# EAGLE design Qwiic-Step (EAGLE 9.5.1)
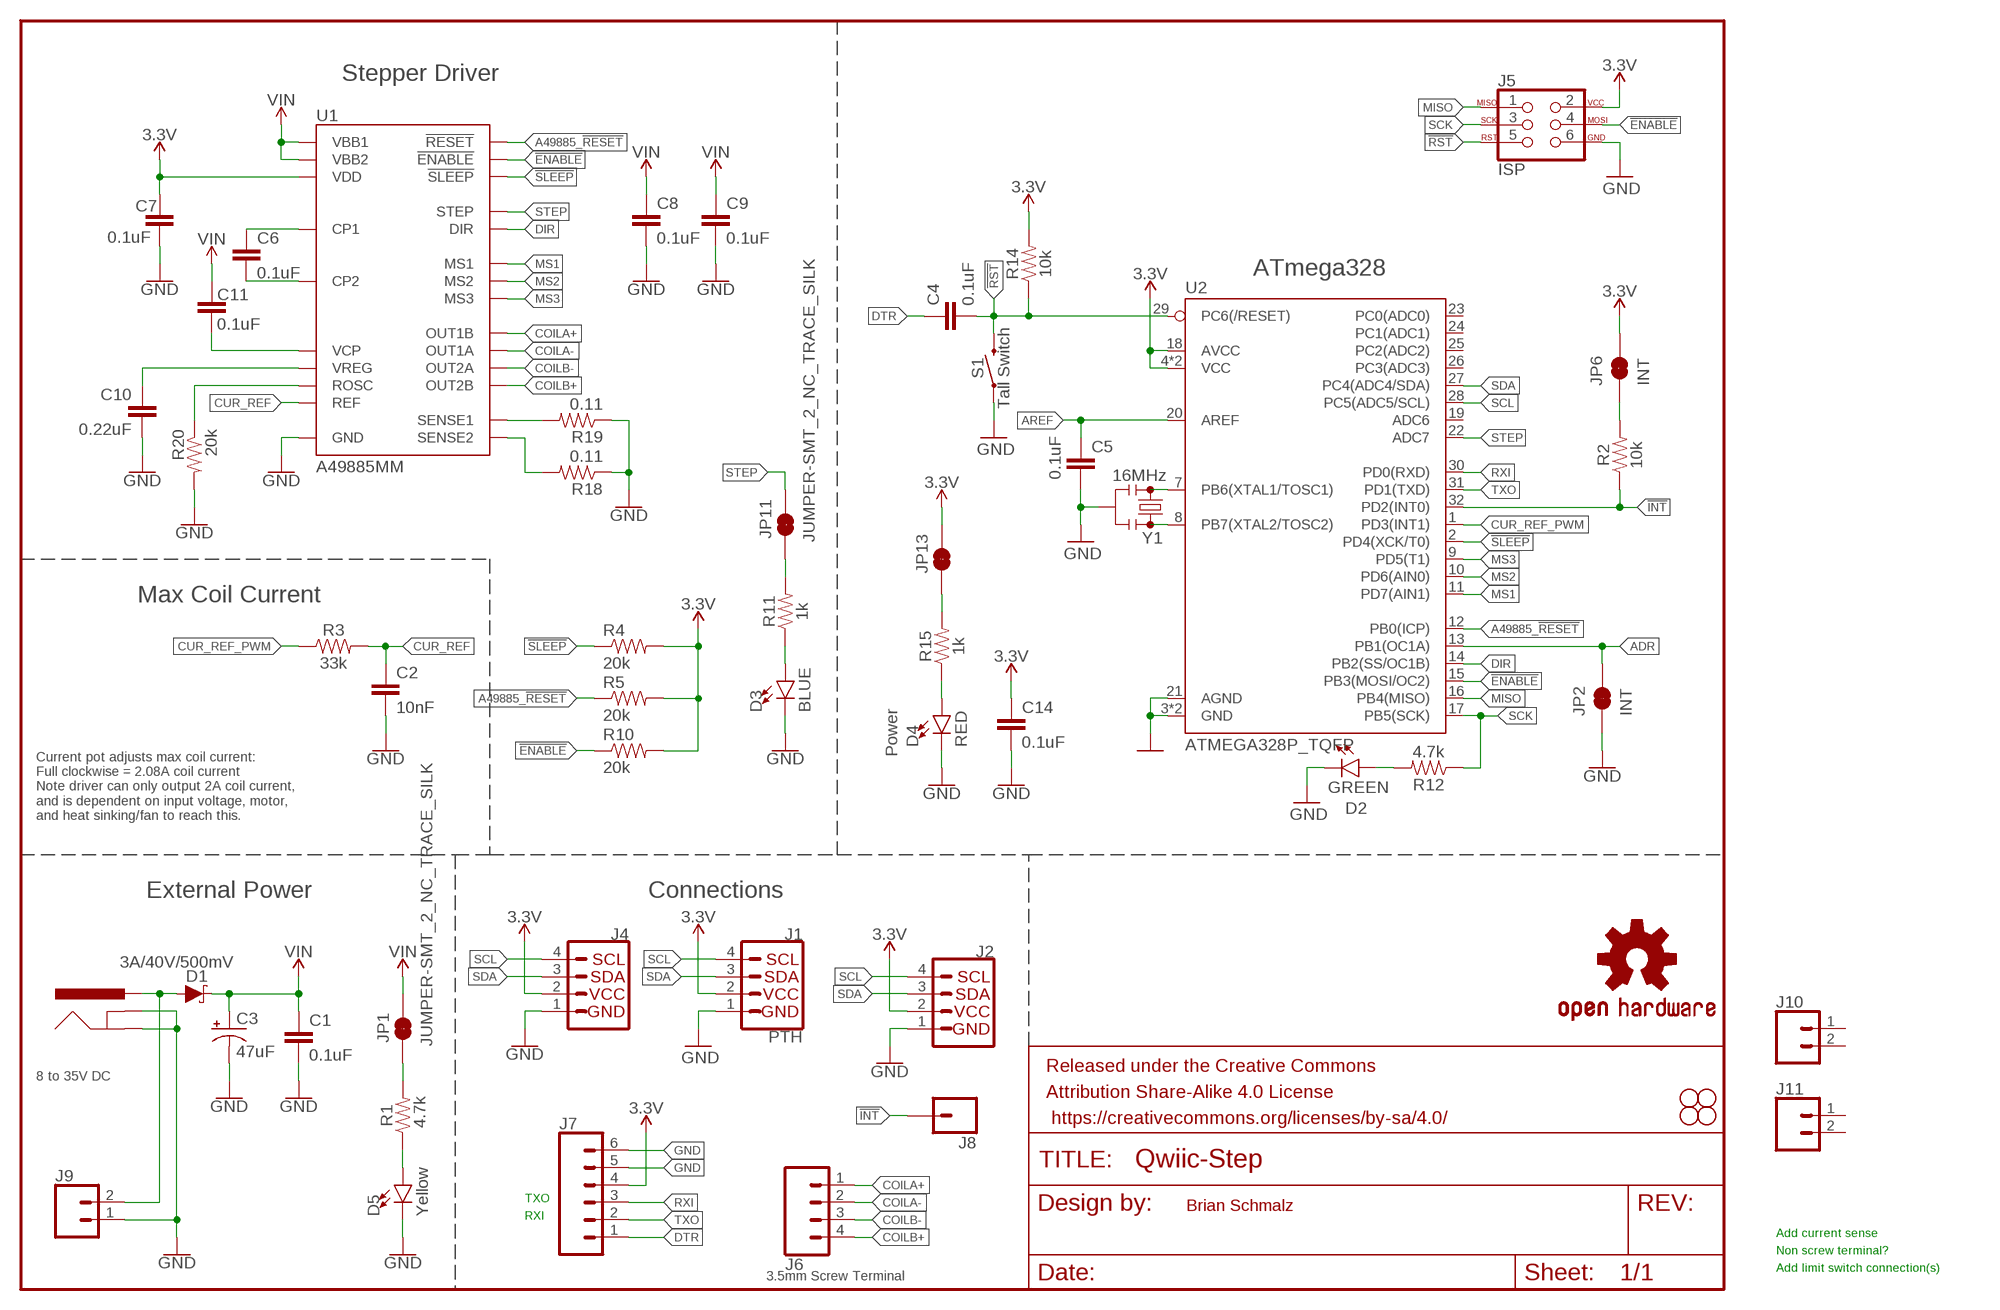
[diagram p0: schematic, sheet 1]

## Parts
C1  0.1uF  0.1UF-0603-100V-10%  [0603]
C2  10nF  10NF-0603-50V-10%  [0603]
C3  47uF  47UF-POLAR-PANASONIC_D-35V-20%  [PANASONIC_D]
C4  0.1uF  0.1UF-0603-100V-10%  [0603]
C5  0.1uF  0.1UF-0603-25V-(+80/-20%)  [0603]
C6  0.1uF  0.1UF-0603-100V-10%  [0603]
C7  0.1uF  0.1UF-0603-25V-(+80/-20%)  [0603]
C8  0.1uF  0.1UF-0603-100V-10%  [0603]
C9  0.1uF  0.1UF-0603-100V-10%  [0603]
C10  0.22uF  0.22UF-0603-50V-(-20/+80%)  [0603]
C11  0.1uF  0.1UF-0603-100V-10%  [0603]
C14  0.1uF  0.1UF-0603-25V-(+80/-20%)  [0603]
D1  3A/40V/500mV  DIODE-SCHOTTKY-B340A  [SMA-DIODE]
D2  GREEN  LED-GREEN0603  [LED-0603]
D3  BLUE  LED-BLUE0603  [LED-0603]
D4  RED  LED-RED0603  [LED-0603]
D5  Yellow  LED-YELLOW0603  [LED-0603]
FRAME1  FRAME-LETTER  [CREATIVE_COMMONS]
J1  PTH  I2C_STANDARD_NO_SILK  [1X04_NO_SILK]
J2  Qwiic Right Angle  I2C_STANDARDQWIIC  [JST04_1MM_RA]
J3  POWER_JACKSUPER_BOMB_DIGITY  [POWER_JACK_SMD_OVERPASTE_SUPER_BOMB_DIGITY]
J4  Qwiic Right Angle  I2C_STANDARDQWIIC  [JST04_1MM_RA]
J5  ISP  AVR_SPI_PROG_3X2TESTPOINTS  [2X3_TEST_POINTS]
J6  CONN_04SCREW  [SCREWTERMINAL-3.5MM-4]
J7  CONN_06NO_SILK_NO_POP  [1X06_NO_SILK]
J8  CONN_01PTH_NO_SILK_YES_STOP  [1X01_NO_SILK]
J9  CONN_023.5MM  [SCREWTERMINAL-3.5MM-2]
J10  CONN_02-JST-2MM-SMT  [JST-2-SMD]
J11  CONN_02-JST-2MM-SMT  [JST-2-SMD]
JP1  JUMPER-SMT_2_NC_TRACE_SILK  [SMT-JUMPER_2_NC_TRACE_SILK]
JP2  INT  JUMPER-SMT_2_NC_TRACE_SILK  [SMT-JUMPER_2_NC_TRACE_SILK]
JP6  INT  JUMPER-SMT_2_NC_TRACE_SILK  [SMT-JUMPER_2_NC_TRACE_SILK]
JP7  STAND-OFF  [STAND-OFF]
JP8  STAND-OFF  [STAND-OFF]
JP9  STAND-OFF  [STAND-OFF]
JP10  STAND-OFF  [STAND-OFF]
JP11  JUMPER-SMT_2_NC_TRACE_SILK  [SMT-JUMPER_2_NC_TRACE_SILK]
JP13  JUMPER-SMT_2_NC_TRACE_SILK  [SMT-JUMPER_2_NC_TRACE_SILK]
LOGO1  OSHW-LOGOMINI  [OSHW-LOGO-MINI]
R1  4.7k  4.7KOHM-0603-1/10W-1%  [0603]
R2  10k  10KOHM-0603-1/10W-1%  [0603]
R3  33k  33KOHM-0603-1/10W-1%  [0603]
R4  20k  20KOHM-0603-1/10W-1%  [0603]
R5  20k  20KOHM-0603-1/10W-1%  [0603]
R10  20k  20KOHM-0603-1/10W-1%  [0603]
R11  1k  1KOHM-0603-1/10W-1%  [0603]
R12  4.7k  4.7KOHM-0603-1/10W-1%  [0603]
R14  10k  10KOHM-0603-1/10W-1%  [0603]
R15  1k  1KOHM-0603-1/10W-1%  [0603]
R18  0.11  0.11OHM-2010-1/2W-1%  [2010]
R19  0.11  0.11OHM-2010-1/2W-1%  [2010]
R20  20k  20KOHM-0603-1/10W-1%  [0603]
S1  Tall Switch  MOMENTARY-SWITCH-SPST-SMD-5.2-TALL-REDUNDANT  [TACTILE_SWITCH_SMD_5.2MM]
U1  A49885MM  [QFN-28-5MM]
U2  ATMEGA328P_TQFP  [TQFP32-08]
Y1  16MHz  RESONATOR-16MHZSMD_3.2X1.3  [RESONATOR-SMD-3.2X1.3]

## Nets
3.3V: C7.1 C14.1 J1.2(VCC) J2.2 J4.2 J5.2 J7.4 JP6.2 JP13.2 R4.2 R5.2 R10.2 R14.2 U1.15(VDD) U2.4(VCC) U2.6(VCC) U2.18(AVCC)
!ENABLE!: J5.4 R10.1 U1.2(!ENABLE!) U2.15(PB3(MOSI/OC2))
!INT!: J8.1 R2.1 U2.32(PD2(INT0))
!RST!: C4.2 J5.5 R14.1 S1.3 S1.4 U2.29(PC6(/RESET))
!SLEEP!: R4.1 U1.14(!SLEEP!) U2.2(PD4(XCK/T0))
A49885_!RESET!: R5.1 U1.12(!RESET!) U2.12(PB0(ICP))
ADR: JP2.2 U2.13(PB1(OC1A))
AREF: C5.1 U2.20(AREF)
COILA+: J6.1 U1.21(OUT1B)
COILA-: J6.2 U1.24(OUT1A)
COILB+: J6.4 U1.1(OUT2B)
COILB-: J6.3 U1.26(OUT2A)
CUR_REF: C2.1 R3.2 U1.17(REF)
CUR_REF_PWM: R3.1 U2.1(PD3(INT1))
DIR: U1.19(DIR) U2.14(PB2(SS/OC1B))
DTR: C4.1 J7.1
GND: C1.2 C2.2 C3.- C5.2 C7.2 C8.2 C9.2 C10.2 C14.2 D2.C D3.C D4.C D5.C J1.1(GND) J2.1 J3.GND(GNDBREAK) J3.P$4(GND) J4.1 J5.6 J7.5 J7.6 J9.1 JP2.1 R18.1 R19.1 R20.2 S1.1 S1.2 U1.3(GND) U1.18(GND) U1.29(GND) U2.3(GND) U2.5(GND) U2.21(AGND) Y1.2
MISO: J5.1 U2.16(PB4(MISO))
MS1: U1.9(MS1) U2.11(PD7(AIN1))
MS2: U1.10(MS2) U2.10(PD6(AIN0))
MS3: U1.11(MS3) U2.9(PD5(T1))
N$1: D3.A R11.1
N$4: JP1.1 R1.2
N$5: JP6.1 R2.2
N$7: D1.A J3.VIN0(PWR) J9.2
N$8: C6.1 U1.4(CP1)
N$9: C6.2 U1.5(CP2)
N$10: D5.A R1.1
N$11: JP11.1 R11.2
N$12: D2.A R12.2
N$13: U2.7(PB6(XTAL1/TOSC1)) Y1.1
N$14: U2.8(PB7(XTAL2/TOSC2)) Y1.3
N$19: R20.1 U1.13(ROSC)
N$20: C10.1 U1.8(VREG)
N$21: C11.1 U1.6(VCP)
N$26: D4.A R15.1
N$27: JP13.1 R15.2
N$31: R18.2 U1.27(SENSE2)
N$32: R19.2 U1.23(SENSE1)
RXI: J7.3 U2.30(PD0(RXD))
SCK: J5.3 R12.1 U2.17(PB5(SCK))
SCL: J1.4(SCL) J2.4 J4.4 U2.28(PC5(ADC5/SCL))
SDA: J1.3(SDA) J2.3 J4.3 U2.27(PC4(ADC4/SDA))
STEP: JP11.2 U1.16(STEP) U2.22(ADC7)
TXO: J7.2 U2.31(PD1(TXD))
VIN [PWR]: C1.1 C3.+ C8.1 C9.1 C11.2 D1.C JP1.2 U1.22(VBB1) U1.28(VBB2)
Unconnected: J10.1 J10.2 J11.1 J11.2 U2.19(ADC6) U2.23(PC0(ADC0)) U2.24(PC1(ADC1)) U2.25(PC2(ADC2)) U2.26(PC3(ADC3))

## Notes on the sheet
- Stepper Driver
- ATmega328
- Max Coil Current
- Power
- Current pot adjusts max coil current:
  Full clockwise = 2.08A coil current
  Note driver can only output 2A coil current,
  and is dependent on input voltage, motor,
  and heat sinking/fan to reach this.
- External Power | Connections
- 8 to 35V DC
- TXO
- Brian Schmalz
- RXI
- Add current sense
- Non screw terminal?
- Add limit switch connection(s)
- 3.5mm Screw Terminal

## Library data of the parts
C1 C4 C6 C8 C9 C11 = SparkFun-Capacitors:0.1UF: 0.1µF ceramic capacitors A capacitor is a passive two-terminal electrical component used to store electrical energy temporarily in an electric field.; PROD_ID: CAP-08390
C2 = SparkFun-Capacitors:10NF: 0.01uF/10nF/10,000pF ceramic capacitors A capacitor is a passive two-terminal electrical component used to store electrical energy temporarily in an electric field. CAP-09321; PROD_ID: CAP-00867
C3 = SparkFun-Capacitors:47UF-POLAR: 47µF polarized capacitors A capacitor is a passive two-terminal electrical component used to store electrical energy temporarily in an electric field.; PROD_ID: CAP-08478
C5 C7 C14 = SparkFun-Capacitors:0.1UF: 0.1µF ceramic capacitors A capacitor is a passive two-terminal electrical component used to store electrical energy temporarily in an electric field.; PROD_ID: CAP-00810
C10 = SparkFun-Capacitors:0.22UF: 0.22µF ceramic capacitors A capacitor is a passive two-terminal electrical component used to store electrical energy temporarily in an electric field.; PROD_ID: CAP-09885
D1 = SparkFun-DiscreteSemi:DIODE-SCHOTTKY: Schottky diode A Schottky diode is a semiconductor diode which has a low forward voltage drop and a very fast switching action.; PROD_ID: DIO-09886
D2 = SparkFun-LED:LED-GREEN: Green SMD LED Used in manufacturing of various products at SparkFun Packages: 0603 - SMD 0603 package [Product Link] <http://www.futureelectronics.com/en/technologies/semiconductors/optoelectronics/leds/Pages/9894312-LTST-C190GKT.aspx?CrossPart=HSMG-C190&IM=0> LilyPad 1206 - SMD1206 LilyPad package [Product Link] <http://www.futureelectronics.com/en/Technologies/Product.aspx?ProductID=IN150NGHARVATEKCORPORATION2049943&IM=0> 1206 - SMD1206 package [Product Link] <http://www.futureelectronics.com/en/technologies/semiconductors/optoelectronics/leds/Pages/8315665-LTST-C150KGKT.aspx?IM=0> 1206 Bottom Mount -SMD 1206 Bottom Mount [Product Link] <http://www.digikey.com/product-detail/en/lite-on-inc/LTST-C230KGKT/160-1456-1-ND/386854> SparkFun Products: Pro Mini 328 -5V <https://www.sparkfun.com/products/821> RedBoard <https://www.sparkfun.com/products/12757> MP3 Trigger <https://www.sparkfun.com/products/13720> Makey Makey <https://www.sparkfun.com/products/11076>; PROD_ID: DIO-00821
D3 = SparkFun-LED:LED-BLUE: Blue SMD LED Used in manufacturing of various products at SparkFun Packages: 0603 - SMD 0603 package [Product Link] <http://www.digikey.com/product-detail/en/SMLE12BC7TT86/511-1589-2-ND/1641808> 1206 - SMD1206 package [Product Link] <http://www.digikey.com/product-detail/en/lite-on-inc/LTST-C150TBKT/160-1643-1-ND/573584> SparkFun Products: ESP8266 Thing-Dev Board <https://www.sparkfun.com/products/13711> RedBoard <https://www.sparkfun.com/products/12757>; PROD_ID: DIO-08575
D4 = SparkFun-LED:LED-RED: Red SMD LED Used in manufacturing of most products at SparkFun Packages: 0603 - SMD 0603 package [Product Link] <http://docs.avagotech.com/docs/AV02-0551EN> 0603 SMART - SMD 0603 SMART package ( more efficient and expensive)[Product Link] <http://www.osram-os.com/Graphics/XPic2/00077099_0.pdf> 1206 - SMD1206 package [Product Link] <https://www.sparkfun.com/datasheets/DevTools/LilyPad/Q150OVS4.pdff> SparkFun Products: Pro Mini 328 -5V <https://www.sparkfun.com/products/821> RedBoard <https://www.sparkfun.com/products/12757> IOIO-OTG <https://www.sparkfun.com/products/13613>; PROD_ID: DIO-00819
D5 = SparkFun-LED:LED-YELLOW: Yellow SMD LED Used in manufacturing several products at SparkFun. Packages: 0603 - SMD 0603 package[Product Link] <http://www.kingbrightusa.com/product.asp?catalog_name=LED&product_id=APT1608SYCK> 0603 -SMART - SMART SMD 0603 package (more efficient/more expensive) [Product Link] <http://www.osram-os.com/osram_os/en/products/product-catalog/led-light-emitting-diodes/smartled-0603/ly-l29k/index.jsp> LilyPad - SMD1206 package[Product Datasheet] <https://www.sparkfun.com/datasheets/DevTools/LilyPad/Q150YUS4.pdf> SparkFun Products: Blynk Board <https://www.sparkfun.com/products/13794> IOIO-OTG <https://www.sparkfun.com/products/13613> XBee Explorer Serial <https://www.sparkfun.com/products/13225>; PROD_ID: DIO-09003
FRAME1 = SparkFun-Aesthetics:FRAME-LETTER: Schematic Frame - Letter Standard 8.5x11 US Letter frame
J1 = SparkX:I2C_STANDARD: SparkFun I2C Standard Pinout Header SparkFun has standardized on a pinout for all I2C based sensor breakouts. This pinout allows I2C boards to be plugged directly into the headers on Arduino Uno compatible boards, and to be daisy chained easily. Example SparkFun Products: SparkFun Atmospheric Sensor Breakout - BME280 <https://www.sparkfun.com/products/13676> SparkFun Altitude/Pressure Sensor Breakout - MPL3115A2 <https://www.sparkfun.com/products/11084> SparkFun TOF Range Finder Sensor - VL6180 <https://www.sparkfun.com/products/12785>
J2 J4 = SparkFun-Connectors:I2C_STANDARD: SparkFun I2C Standard Pinout Header SparkFun has standardized on a pinout for all I2C based sensor breakouts. This pinout allows I2C boards to be plugged directly into the headers on Arduino Uno compatible boards, and to be daisy chained easily. Example SparkFun Products: SparkFun Atmospheric Sensor Breakout - BME280 <https://www.sparkfun.com/products/13676> SparkFun Altitude/Pressure Sensor Breakout - MPL3115A2 <https://www.sparkfun.com/products/11084> SparkFun TOF Range Finder Sensor - VL6180 <https://www.sparkfun.com/products/12785>; PROD_ID: CONN-13694
J3 = Testing:POWER_JACK: Power Jack This is the standard 5.5mm barrel jack for power. The PTH is the most common, proven, reliable, footprint. All others are experimental. The Slot footprint only works if the mill layer is transmitted to the PCB fab house so be warned. Spark Fun Electronics SKU : PRT-00119. Mating wall wart : TOL-00298 (and others); PROD_ID: CONN-08106
J5 = SparkFun-Connectors:AVR_SPI_PROG_3X2: AVR ISP 6 Pin This is the reduced ISP connector for AVR programming. Common on Arduino. This footprint will take up less PCB space and can be used with a 10-pin to 6-pin adapter such as SKU: BOB-08508 **Special note about "TEST_POINT" package. The stop mask is on the top side, so if you want your programming test points to be on the bottom of your board, make sure to place this package on the bottom side of the board. This also ensure that the orientation to program from the bottom side will be correct. SparkFun Products: SparkFun ISP Pogo Adapter <https://www.sparkfun.com/products/11591> - NS Tiny AVR Programmer <https://www.sparkfun.com/products/11801> -PTH
J6 = SparkFun-Connectors:CONN_04: Multi connection point. Often used as Generic Header-pin footprint for 0.1 inch spaced/style header connections On any of the 0.1 inch spaced packages, you can populate with these: Break Away Headers - Straight <https://www.sparkfun.com/products/116> (PRT-00116) Break Away Male Headers - Right Angle <https://www.sparkfun.com/products/553> (PRT-00553) Female Headers <https://www.sparkfun.com/products/115> (PRT-00115) Break Away Headers - Machine Pin <https://www.sparkfun.com/products/117> (PRT-00117) Break Away Female Headers - Swiss Machine Pin <https://www.sparkfun.com/products/743> (PRT-00743) For SCREWTERMINALS and SPRING TERMINALS visit here: Screw Terimnals on SparkFun.com <https://www.sparkfun.com/search/results?term=Screw+Terminals> (5mm/3.5mm/2.54mm spacing) This device is also useful as a general connection point to wire up your design to another part of your project. Our various solder wires solder well into these plated through hole pads. Hook-Up Wire - Assortment (Stranded, 22 AWG) <https://www.sparkfun.com/products/11375> (PRT-11375) Hook-Up Wire - Assortment (Solid Core, 22 AWG) <https://www.sparkfun.com/products/11367> (PRT-11367) View the entire wire category on our website here <https://www.sparkfun.com/categories/141> Special notes: Molex polarized connector foot print use with SKU : PRT-08231 with associated crimp pins and housings. 1MM SMD Version SKU: PRT-10208; PROD_ID: CONN-14485
J7 = SparkFun-Connectors:CONN_06: Multi connection point. Often used as Generic Header-pin footprint for 0.1 inch spaced/style header connections On any of the 0.1 inch spaced packages, you can populate with these: Break Away Headers - Straight <https://www.sparkfun.com/products/116> (PRT-00116) Break Away Male Headers - Right Angle <https://www.sparkfun.com/products/553> (PRT-00553) Female Headers <https://www.sparkfun.com/products/115> (PRT-00115) Break Away Headers - Machine Pin <https://www.sparkfun.com/products/117> (PRT-00117) Break Away Female Headers - Swiss Machine Pin <https://www.sparkfun.com/products/743> (PRT-00743) Arduino Stackable Header - 6 Pin <https://www.sparkfun.com/products/9280> (PRT-09280) For SCREWTERMINALS and SPRING TERMINALS visit here: Screw Terimnals on SparkFun.com <https://www.sparkfun.com/search/results?term=Screw+Terminals> (5mm/3.5mm/2.54mm spacing) This device is also useful as a general connection point to wire up your design to another part of your project. Our various solder wires solder well into these plated through hole pads. Hook-Up Wire - Assortment (Stranded, 22 AWG) <https://www.sparkfun.com/products/11375> (PRT-11375) Hook-Up Wire - Assortment (Solid Core, 22 AWG) <https://www.sparkfun.com/products/11367> (PRT-11367) View the entire wire category on our website here <https://www.sparkfun.com/categories/141>
J8 = SparkFun-Connectors:CONN_01: Single connection point. Often used as Generic Header-pin footprint for 0.1 inch spaced/style header connections On any of the 0.1 inch spaced packages, you can populate with these: Break Away Headers - Straight <https://www.sparkfun.com/products/116> (PRT-00116) Break Away Male Headers - Right Angle <https://www.sparkfun.com/products/553> (PRT-00553) Female Headers <https://www.sparkfun.com/products/115> (PRT-00115) Break Away Headers - Machine Pin <https://www.sparkfun.com/products/117> (PRT-00117) Break Away Female Headers - Swiss Machine Pin <https://www.sparkfun.com/products/743> (PRT-00743) This device is also useful as a general connection point to wire up your design to another part of your project. Our various solder wires solder well into these plated through hole pads. Hook-Up Wire - Assortment (Stranded, 22 AWG) <https://www.sparkfun.com/products/11375> (PRT-11375) Hook-Up Wire - Assortment (Solid Core, 22 AWG) <https://www.sparkfun.com/products/11367> (PRT-11367) View the entire wire category on our website here <https://www.sparkfun.com/categories/141> Special notes: SMTSO-256-ET is a "flush mount" nut for a 4-40 screw. We mostly use this on specialty testbeds; it is a nice way to connect hardware to your PCB at an adjustable hieght. Also note, the SNAP packages are for using a snappable style connector. We sell a baggie of snaps and they are also used on two LilyPad designs: Snap Assortment - 30 pack (male and female) <https://www.sparkfun.com/products/11347> (DEV-11347) LilyPad Arduino SimpleSnap <https://www.sparkfun.com/products/10941> (DEV-10941) LilyPad SimpleSnap Protoboard <https://www.sparkfun.com/products/10940> (DEV-10940)
J9 = SparkFun-Connectors:CONN_02: Multi connection point. Often used as Generic Header-pin footprint for 0.1 inch spaced/style header connections On any of the 0.1 inch spaced packages, you can populate with these: Break Away Headers - Straight <https://www.sparkfun.com/products/116> (PRT-00116) Break Away Male Headers - Right Angle <https://www.sparkfun.com/products/553> (PRT-00553) Female Headers <https://www.sparkfun.com/products/115> (PRT-00115) Break Away Headers - Machine Pin <https://www.sparkfun.com/products/117> (PRT-00117) Break Away Female Headers - Swiss Machine Pin <https://www.sparkfun.com/products/743> (PRT-00743) For SCREWTERMINALS and SPRING TERMINALS visit here: Screw Terimnals on SparkFun.com <https://www.sparkfun.com/search/results?term=Screw+Terminals> (5mm/3.5mm/2.54mm spacing) This device is also useful as a general connection point to wire up your design to another part of your project. Our various solder wires solder well into these plated through hole pads. Hook-Up Wire - Assortment (Stranded, 22 AWG) <https://www.sparkfun.com/products/11375> (PRT-11375) Hook-Up Wire - Assortment (Solid Core, 22 AWG) <https://www.sparkfun.com/products/11367> (PRT-11367) View the entire wire category on our website here <https://www.sparkfun.com/categories/141> Special notes: Molex polarized connector foot print use with: PRT-08233 with associated crimp pins and housings. 2.54_SCREWTERM for use with PRT-10571. 3.5mm Screw Terminal footprints for PRT-08084 5mm Screw Terminal footprints for use with PRT-08432; PROD_ID: CONN-08399
J10 J11 = SparkFun-Connectors:CONN_02: Multi connection point. Often used as Generic Header-pin footprint for 0.1 inch spaced/style header connections On any of the 0.1 inch spaced packages, you can populate with these: Break Away Headers - Straight <https://www.sparkfun.com/products/116> (PRT-00116) Break Away Male Headers - Right Angle <https://www.sparkfun.com/products/553> (PRT-00553) Female Headers <https://www.sparkfun.com/products/115> (PRT-00115) Break Away Headers - Machine Pin <https://www.sparkfun.com/products/117> (PRT-00117) Break Away Female Headers - Swiss Machine Pin <https://www.sparkfun.com/products/743> (PRT-00743) For SCREWTERMINALS and SPRING TERMINALS visit here: Screw Terimnals on SparkFun.com <https://www.sparkfun.com/search/results?term=Screw+Terminals> (5mm/3.5mm/2.54mm spacing) This device is also useful as a general connection point to wire up your design to another part of your project. Our various solder wires solder well into these plated through hole pads. Hook-Up Wire - Assortment (Stranded, 22 AWG) <https://www.sparkfun.com/products/11375> (PRT-11375) Hook-Up Wire - Assortment (Solid Core, 22 AWG) <https://www.sparkfun.com/products/11367> (PRT-11367) View the entire wire category on our website here <https://www.sparkfun.com/categories/141> Special notes: Molex polarized connector foot print use with: PRT-08233 with associated crimp pins and housings. 2.54_SCREWTERM for use with PRT-10571. 3.5mm Screw Terminal footprints for PRT-08084 5mm Screw Terminal footprints for use with PRT-08432; PROD_ID: CONN-11443
JP1 JP2 JP6 JP11 JP13 = SparkFun-Jumpers:JUMPER-SMT_2_NC_TRACE: Normally closed trace jumper This jumper has a trace between two pads so it's normally closed (NC). Use a razor knife to open the connection. For best results follow the IPC guidelines for cutting traces: Cutout at least 0.063 mm (0.005 in). Remove all loose material to clean up the cut area. Seal the cut with an approved epoxy. Reapply solder to reclose the connection.
JP7-JP10 = SparkFun-7-28-09:STAND-OFF: Stand Off This is the mechanical footprint for a #4 phillips button head screw. Use the keepout ring to avoid running the screw head into surrounding components. SKU : PRT-00447
LOGO1 = SparkFun-Aesthetics:OSHW-LOGO: Open-Source Hardware (OSHW) Logo This logo indicates the piece of hardware it is found on incorporates a OSHW license and/or adheres to the definition of open source hardware found here: http://freedomdefined.org/OSHW
R1 R12 = SparkFun-Resistors:4.7KOHM: 4.7kΩ resistor A resistor is a passive two-terminal electrical component that implements electrical resistance as a circuit element. Resistors act to reduce current flow, and, at the same time, act to lower voltage levels within circuits. - Wikipedia; PROD_ID: RES-07857
R2 R14 = SparkFun-Resistors:10KOHM: 10kΩ resistor A resistor is a passive two-terminal electrical component that implements electrical resistance as a circuit element. Resistors act to reduce current flow, and, at the same time, act to lower voltage levels within circuits. - Wikipedia; PROD_ID: RES-00824
R3 = SparkFun-Resistors:33KOHM: 33kΩ resistor A resistor is a passive two-terminal electrical component that implements electrical resistance as a circuit element. Resistors act to reduce current flow, and, at the same time, act to lower voltage levels within circuits. - Wikipedia; PROD_ID: RES-08416
R4 R5 R10 R20 = SparkFun-Resistors:20KOHM: 20kΩ resistor A resistor is a passive two-terminal electrical component that implements electrical resistance as a circuit element. Resistors act to reduce current flow, and, at the same time, act to lower voltage levels within circuits. - Wikipedia; PROD_ID: RES-09383
R11 R15 = SparkFun-Resistors:1KOHM: 1kΩ resistor A resistor is a passive two-terminal electrical component that implements electrical resistance as a circuit element. Resistors act to reduce current flow, and, at the same time, act to lower voltage levels within circuits. - Wikipedia; PROD_ID: RES-07856
R18 R19 = SparkFun-Resistors:0.11OHM: 0.11Ω resistor A resistor is a passive two-terminal electrical component that implements electrical resistance as a circuit element. Resistors act to reduce current flow, and, at the same time, act to lower voltage levels within circuits. - Wikipedia; PROD_ID: RES-08354
S1 = SparkFun-Switches:MOMENTARY-SWITCH-SPST: Momentary Switch (Pushbutton) - SPST Normally-open (NO) SPST momentary switches (buttons, pushbuttons). Variants PTH-12MM - 12mm square, through-hole Momentary Pushbutton Switch - 12mm Square <https://www.sparkfun.com/products/9190> (COM-09190) PTH-6.0MM, PTH-6.0MM-KIT - 6.0mm square, through-hole Mini Pushbutton Switch <https://www.sparkfun.com/products/97> (COM-00097) KIT package intended for soldering kit's - only one side of pads' copper is exposed. PTH-RIGHT-ANGLE-KIT - Right-angle, through-hole Right Angle Tactile Button <https://www.sparkfun.com/products/10791> - Used on SparkFun BigTime Watch Kit <https://www.sparkfun.com/products/11734> SMD-12MM - 12mm square, surface-mount Tactile Button - SMD (12mm) <https://www.sparkfun.com/products/12993> (COM-12993) Used on SparkFun PicoBoard <https://www.sparkfun.com/products/11888> SMD-4.5MM - 4.5mm Square Trackball Switch Used on SparkFun Blackberry Trackballer Breakout <https://www.sparkfun.com/products/13169> SMD-4.6MMX2.8MM - 4.60mm x 2.80mm, surface mount Used on SparkFun SAMD21 Mini Breakout <https://www.sparkfun.com/products/13664> SMD-5.2MM, SMD-5.2-REDUNDANT - 5.2mm square, surface-mount Mini Pushbutton Switch - SMD <https://www.sparkfun.com/products/8720> (COM-08720) Used on Arduino Pro Mini <https://www.sparkfun.com/products/11114> REDUNDANT package connects both switch circuits together SMD-6.0X3.5MM - 6.0 x 3.5mm, surface mount Momentary Reset Switch SMD <https://www.sparkfun.com/products/8229> (COM-08229) SMD-6.2MM-TALL - 6.2mm square, surface mount Tactile Button - SMD (6mm) <https://www.sparkfun.com/products/12992> Used on SparkFun Digital Sandbox <https://www.sparkfun.com/products/12651> SMD-RIGHT-ANGLE - Right-angle, surface mount Used on SparkFun Block for Intel® Edison - Arduino <https://www.sparkfun.com/products/13036>; PROD_ID: SWCH-14139
U1 = SparkFun-PowerIC:A4988: DMOS Microstepping Driver with Translator; PROD_ID: IC-11483
U2 = SparkFun-IC-Microcontroller:ATMEGA328P_TQFP: Popular 328P in QFP Storefront component: ATmega328 - TQFP <https://www.sparkfun.com/products/13448> (COM-13448) Datasheet <http://www.sparkfun.com/datasheets/Components/SMD/ATMega328.pdf> SparkFun Products SparkFun RedBoard - Programmed with Arduino <https://www.sparkfun.com/products/12757> (DEV-12757) Arduino Pro Mini 328 - 5V/16MHz <https://www.sparkfun.com/products/11113> (DEV-11113) Arduino Pro Mini 328 - 3.3V/8MHz <https://www.sparkfun.com/products/11114> (DEV-11114) SparkFun OpenLog <https://www.sparkfun.com/products/13712> (DEV-13712) SparkFun MicroView - OLED Arduino Module <https://www.sparkfun.com/products/12923> (DEV-12923) SparkFun Digital Sandbox <https://www.sparkfun.com/products/12651> (DEV-12651) SparkFun PicoBoard <https://www.sparkfun.com/products/11888> (WIG-11888) Arduino Fio <https://www.sparkfun.com/products/10116> (DEV-10116) LilyPad Arduino 328 Main Board <https://www.sparkfun.com/products/13342> (DEV-13342) SparkFun RedStick <https://www.sparkfun.com/products/13741> (DEV-13741) LilyPad MP3 <https://www.sparkfun.com/products/11013> (DEV-11013) LilyPad Arduino SimpleSnap <https://www.sparkfun.com/products/10941> (DEV-10941) SparkFun Stepoko <https://www.sparkfun.com/products/13899> (ROB-13899) SparkFun Geiger Counter <https://www.sparkfun.com/products/11345> (SEN-11345) SparkFun EL Sequencer <https://www.sparkfun.com/products/12781> (COM-12781) Arduino Pro 328 - 5V/16MHz <https://www.sparkfun.com/products/10915> (DEV-10915) CryptoCape <https://www.sparkfun.com/products/12773> (DEV-12773) SparkFun IR Thermometer Evaluation Board - MLX90614 <https://www.sparkfun.com/products/10740> (SEN-10740) SparkFun RedBot Mainboard <https://www.sparkfun.com/products/12097> (ROB-12097) Arduino Pro 328 - 3.3V/8MHz <https://www.sparkfun.com/products/10914> (DEV-10914) SparkFun Block for Intel® Edison - Arduino <https://www.sparkfun.com/products/13036> (DEV-13036) SparkFun Simon Says - Surface Mount Soldering Kit <https://www.sparkfun.com/products/10935> (KIT-10935) SparkFun 7-Segment Serial Display - Red <https://www.sparkfun.com/products/11441> (COM-11441) SparkFun 7-Segment Serial Display - White <https://www.sparkfun.com/products/11629> (COM-11629) SparkFun 7-Segment Serial Display - Yellow <https://www.sparkfun.com/products/11443> (COM-11443) SparkFun 7-Segment Serial Display - Kelly Green <https://www.sparkfun.com/products/11440> (COM-11440) SparkFun 7-Segment Serial Display - Blue <https://www.sparkfun.com/products/11442> (COM-11442) SparkFun OpenSegment Serial Display - 20mm (Blue) <https://www.sparkfun.com/products/11647> (COM-11647) SparkFun OpenSegment Serial Display - 20mm (Green) <https://www.sparkfun.com/products/11646> (COM-11646) SparkFun OpenSegment Serial Display - 20mm (White) <https://www.sparkfun.com/products/11648> (COM-11648) SparkFun OpenSegment Serial Display - 20mm (Red) <https://www.sparkfun.com/products/11644> (COM-11644) SparkFun OpenSegment Serial Display - 20mm (Yellow) <https://www.sparkfun.com/products/11645> (COM-11645) SparkFun OpenSegment Shield <https://www.sparkfun.com/products/13190> (DEV-13190); PROD_ID: IC-09069
Y1 = SparkFun-Clocks:RESONATOR-16MHZ: 16MHz Resonator Digikey Example <http://www.digikey.com/product-detail/en/murata-electronics-north-america/CSTCE16M0V53-R0/490-1198-1-ND/584635> Frequency: 16MHz Frequency Stability: ±0.3% Frequency Tolerance: ±0.5% Capacitance: 15pF SparkFun Products SparkFun OpenLog <https://www.sparkfun.com/products/13712> SparkFun MicroView - OLED Arduino Module <https://www.sparkfun.com/products/12923>; PROD_ID: XTAL-08900

## Net classes
1 3.3V: width 0.305 mm
2 PWR: width 0.559 mm

## Board
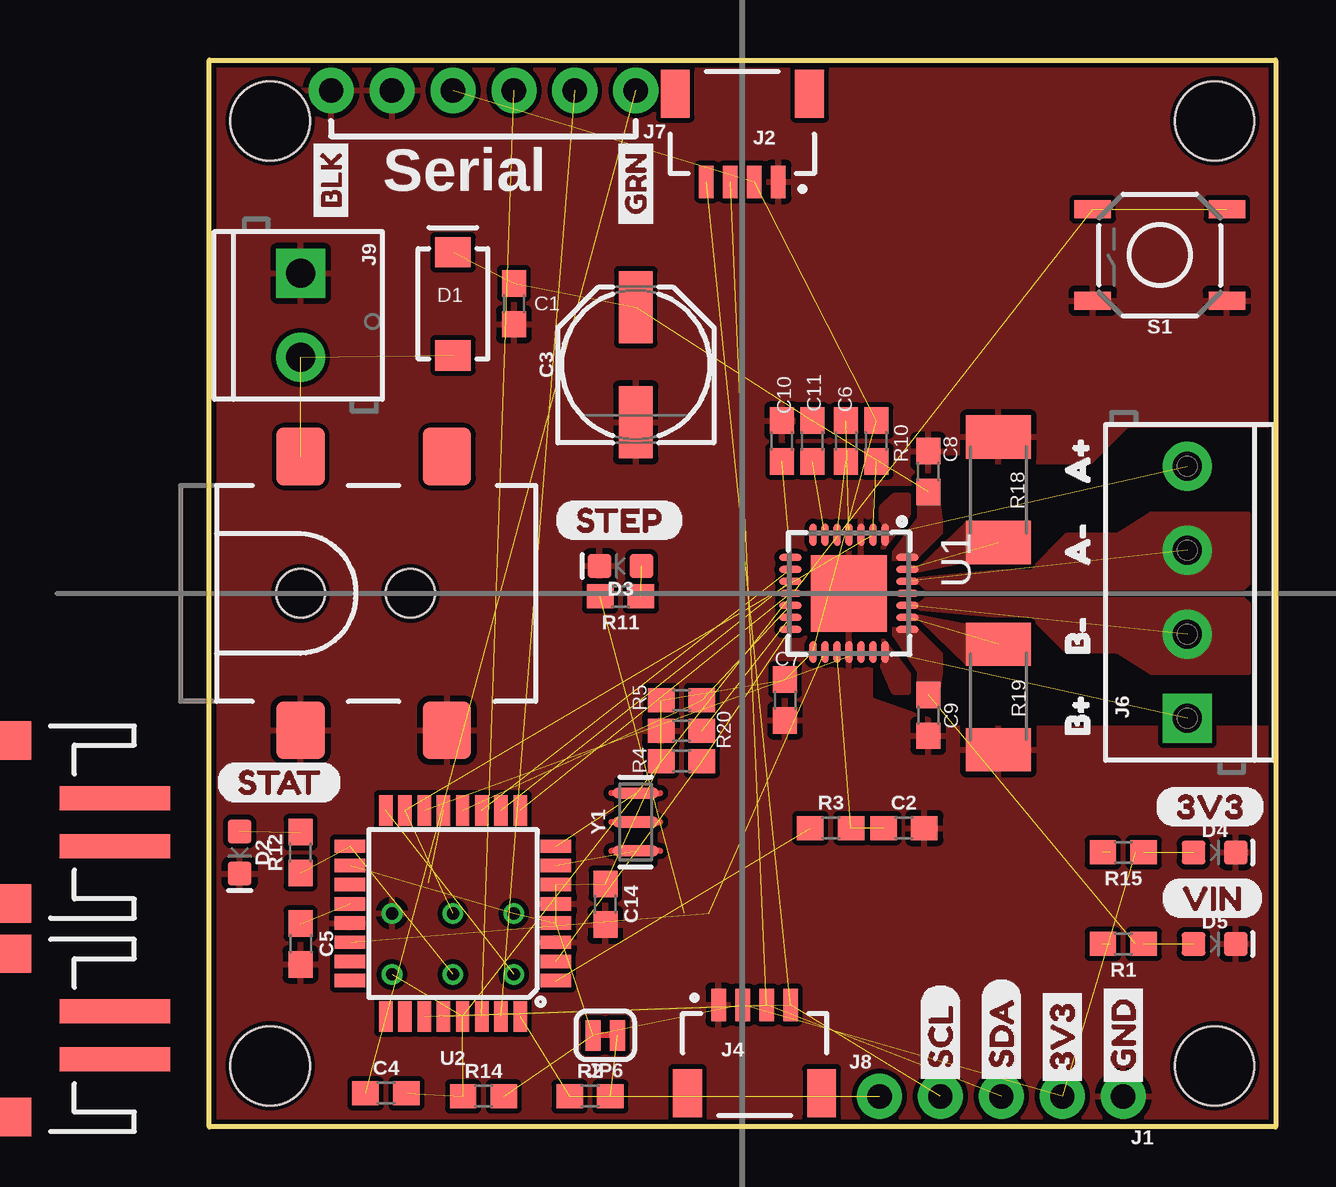
[diagram p1: board, top side]
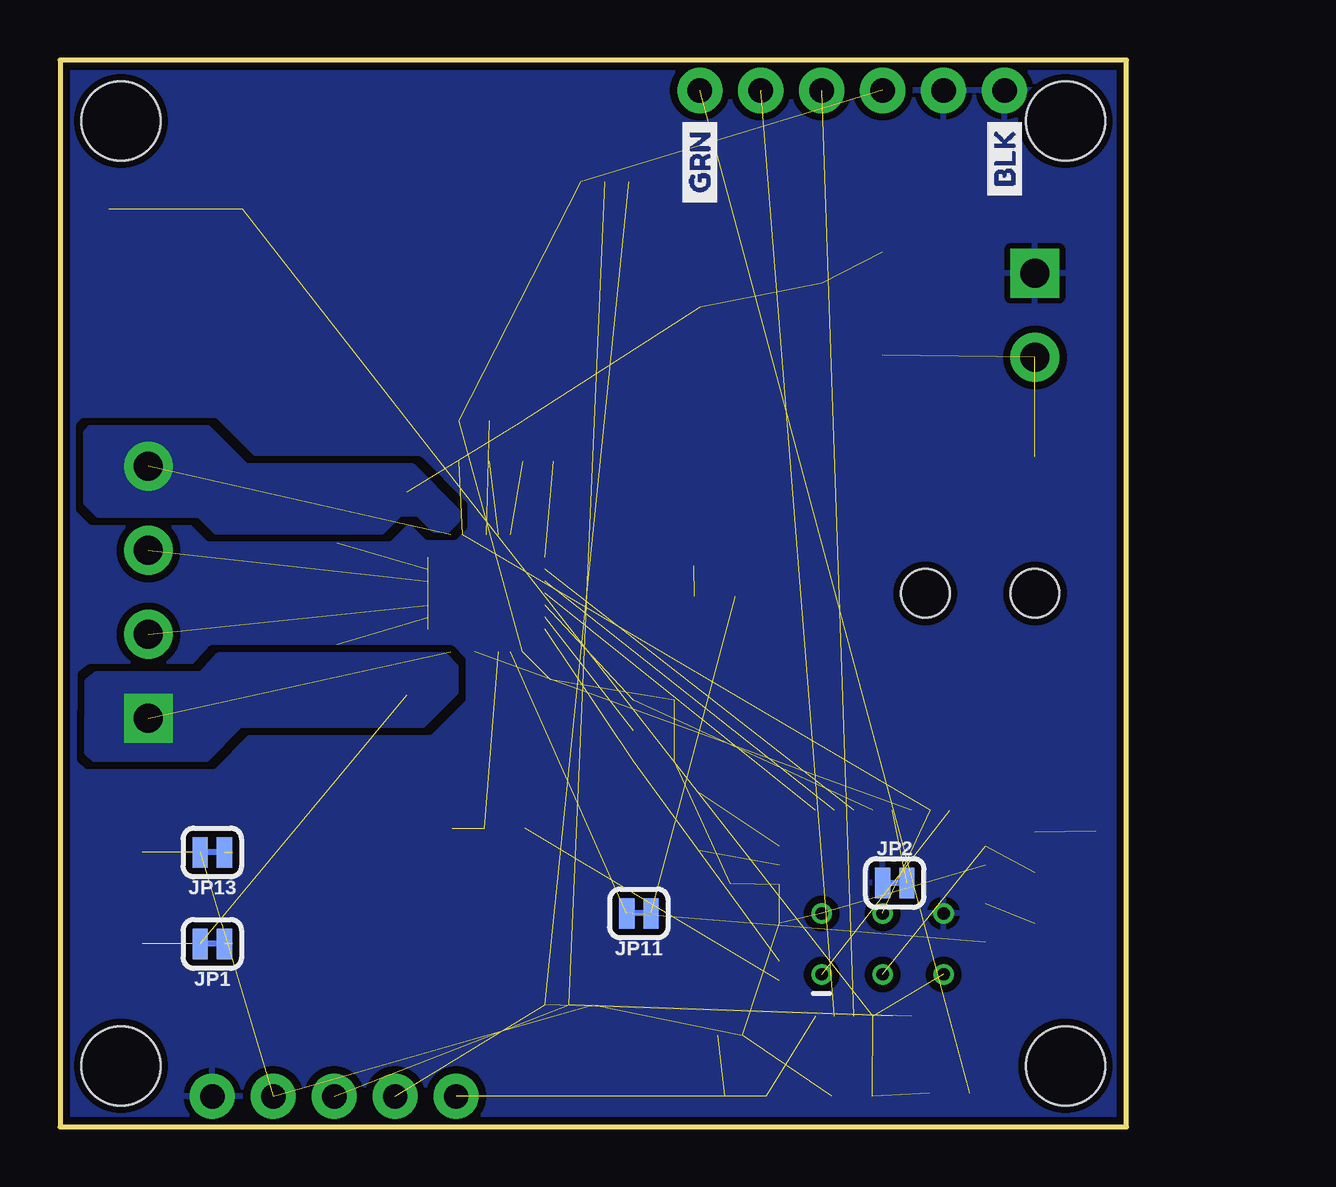
[diagram p2: board, bottom side, seen from below]

Size 44.45 x 44.45 mm. Coordinates in mm from the lower left corner, seen from the top.
Outline: 0,44.45 44.45,44.45 44.45,0 0,0 0,44.45
Copper layers (1*16): Top 0.035mm / dielectric 1.5mm / Bottom 0.035mm
Design rules "SparkFun-2-layer-TIGHT": minimum track width 7mil, minimum drill 15mil, track to track 7mil, track to pad 7mil, pad to pad 7mil, via to via 7mil, smd to smd 7mil, copper to edge 7mil, drill to drill 7mil, minimum pad ring 7mil, minimum via ring 7mil, stop-mask expansion 4mil, vias tented up to drill 25mil, thermal gap 10mil

### Footprints (pad centres in the part's own frame; a part is rotated, then mirrored left to right if it is on the bottom)
0603 = smd 1.1 x 1: 1 -0.85,0; 2 0.85,0
PANASONIC_D = smd 3 x 1.4: + 2.4,0; - -2.4,0
SMA-DIODE = smd 1.27 x 1.47: A -2.15,0; C 2.15,0
LED-0603 = smd 1 x 1: A -0.877,0; C 0.877,0
1X04_NO_SILK = drill 1.016 pad 1.88: 1 0,0; 2 2.54,0; 3 5.08,0; 4 7.62,0
JST04_1MM_RA = smd 0.6 x 1.35: 1 -1.5,0; 2 -0.5,0; 3 0.5,0; 4 1.5,0 | smd 1.2 x 2: NC1 2.8,-3.675; NC2 -2.8,-3.675
POWER_JACK_SMD_OVERPASTE_SUPER_BOMB_DIGITY = smd 2 x 2.4: GND 0,-5.7; P$4 6.1,-5.7; VIN0 0,5.7; VIN1 6.1,5.7 | hole 2.032: 0,0; 4.572,0
2X3_TEST_POINTS = drill 0.508: 1 -2.54,-1.27; 2 -2.54,1.27; 3 0,-1.27; 4 0,1.27; 5 2.54,-1.27; 6 2.54,1.27
SCREWTERMINAL-3.5MM-4 = drill 1.2 pad 2.032 square: 1 0,0 | drill 1.2 pad 2.032: 2 3.5,0; 3 7,0; 4 10.5,0
1X06_NO_SILK = drill 1.016 pad 1.88: 1 0,0; 2 2.54,0; 3 5.08,0; 4 7.62,0; 5 10.16,0; 6 12.7,0
1X01_NO_SILK = drill 1.016 pad 1.88: 1 0,0
SCREWTERMINAL-3.5MM-2 = drill 1.2 pad 2.032 square: 1 0,0 | drill 1.2 pad 2.032: 2 3.5,0
JST-2-SMD = smd 1 x 4.6: 1 -1,-3.7; 2 1,-3.7 | smd 1.6 x 3.4: NC1 -3.4,1.5; NC2 3.4,1.5
SMT-JUMPER_2_NC_TRACE_SILK = smd 0.635 x 1.27: 1 -0.508,0; 2 0.508,0
STAND-OFF = hole 3.302: 0,0
2010 = smd 1.8 x 2.7: 1 -2.2,0; 2 2.2,0
TACTILE_SWITCH_SMD_5.2MM = smd 1.524 x 0.762: 1 -2.794,1.905; 2 2.794,1.905; 3 -2.794,-1.905; 4 2.794,-1.905
QFN-28-5MM = smd 0.94 x 0.3: 1 -2.44,1.5; 2 -2.44,1; 3 -2.44,0.5; 4 -2.44,0; 5 -2.44,-0.5; 6 -2.44,-1; 7 -2.44,-1.5; 15 2.44,-1.5; 16 2.44,-1; 17 2.44,-0.5; 18 2.44,0; 19 2.44,0.5; 20 2.44,1; 21 2.44,1.5 | smd 0.3 x 0.94: 8 -1.5,-2.44; 9 -1,-2.44; 10 -0.5,-2.44; 11 0,-2.44; 12 0.5,-2.44; 13 1,-2.44; 14 1.5,-2.44; 22 1.5,2.44; 23 1,2.44; 24 0.5,2.44; 25 0,2.44; 26 -0.5,2.44; 27 -1,2.44; 28 -1.5,2.44 | smd 3.175 x 3.175: 29 0,0
TQFP32-08 = smd 1.27 x 0.559: 1 -4.293,2.8; 2 -4.293,2; 3 -4.293,1.2; 4 -4.293,0.4; 5 -4.293,-0.4; 6 -4.293,-1.2; 7 -4.293,-2; 8 -4.293,-2.8; 17 4.293,-2.8; 18 4.293,-2; 19 4.293,-1.2; 20 4.293,-0.4; 21 4.293,0.4; 22 4.293,1.2; 23 4.293,2; 24 4.293,2.8 | smd 0.559 x 1.27: 9 -2.8,-4.293; 10 -2,-4.293; 11 -1.2,-4.293; 12 -0.4,-4.293; 13 0.4,-4.293; 14 1.2,-4.293; 15 2,-4.293; 16 2.8,-4.293; 25 2.8,4.293; 26 2,4.293; 27 1.2,4.293; 28 0.4,4.293; 29 -0.4,4.293; 30 -1.2,4.293; 31 -2,4.293; 32 -2.8,4.293
RESONATOR-SMD-3.2X1.3 = smd 0.45 x 1.905: 1 -1.2,0; 2 0,0; 3 1.2,0

### Placement (x,y rotation side)
C1  12.7,34.29 270 top
C2  28.96,12.45 0 top
C3  17.78,31.75 90 top
C4  7.37,1.4 0 top
C5  3.81,7.62 270 top
C6  26.54,28.57 270 top
C7  24,17.78 270 top
C8  29.97,27.3 90 top
C9  29.97,17.14 270 top
C10  23.88,28.57 90 top
C11  25.15,28.57 90 top
C14  16.51,9.27 270 top
D1  10.16,34.29 90 top
D2  1.27,11.43 270 top
D3  17.14,23.37 180 top
D4  41.91,11.43 0 top
D5  41.91,7.62 0 top
FRAME1  -11.78,-15.24 0 top  (outside the outline)
J1  38.1,1.27 180 top
J2  22.23,39.37 180 top
J3  3.81,22.23 0 top
J4  22.73,5.08 0 top
J5  10.16,7.62 0 bottom
J6  40.77,17.02 90 top
J7  17.78,43.18 180 top
J8  27.94,1.27 0 top
J9  3.81,35.56 270 top
J10  -7.62,12.7 90 top  (outside the outline)
J11  -7.62,3.81 90 top  (outside the outline)
JP1  38.1,7.62 180 bottom
JP2  9.65,10.16 0 bottom
JP6  16.51,3.81 180 top
JP7  41.91,2.54 0 top
JP8  2.54,41.91 0 top
JP9  2.54,2.54 0 top
JP10  41.91,41.91 0 top
JP11  20.32,8.89 180 bottom
JP13  38.1,11.43 180 bottom
LOGO1  -21.59,27.94 0 top  (outside the outline)
R1  38.1,7.62 180 top
R2  15.88,1.27 0 top
R3  25.91,12.45 0 top
R4  19.68,15.24 180 top
R5  19.68,17.78 180 top
R10  27.81,28.57 90 top
R11  17.14,22.1 180 top
R12  3.81,11.43 90 top
R14  11.43,1.27 0 top
R15  38.1,11.43 180 top
R18  32.89,26.54 270 top
R19  32.89,17.91 90 top
R20  19.68,16.51 180 top
S1  39.62,36.32 180 top
U1  26.67,22.23 270 top
U2  10.16,8.89 180 top
U$1  [3V30]  39.37,13.34 0 top
U$2  [3V37]  35.56,1.4 90 top
U$3  [GND8]  38.1,1.4 90 top
U$4  [STAT5]  0.25,14.35 0 top
U$5  [SCL5]  30.48,1.52 90 top
U$6  [SDA6]  33.02,1.52 90 top
U$7  [STEP4]  14.35,25.27 0 top
U$8  [VIN3]  39.62,9.53 0 top
U$9  [DTR5]  -10.03,36.96 90 top  (outside the outline)
U$10  [GND1]  -20.19,36.83 90 top  (outside the outline)
U$11  [GND1]  -22.73,36.83 90 top  (outside the outline)
U$12  [RXI3]  -15.11,37.47 90 top  (outside the outline)
U$13  [TXO4]  -12.57,36.7 90 top  (outside the outline)
U$14  [VIN2]  -17.65,37.34 90 top  (outside the outline)
U$15  [A#0]  36.2,25.91 90 top
U$16  [A#1]  36.2,22.48 90 top
U$17  [B#2]  36.2,15.37 90 top
U$18  [B#3]  36.2,18.8 90 top
U$19  [SPARKX-MEDIUM]  -19.05,31.75 0 top  (outside the outline)
U$20  [BLK2]  5.08,37.47 90 top
U$21  [BLK2]  5.08,38.35 90 bottom
U$22  [GRN1]  17.78,38.1 90 bottom
U$28  [GRN1]  17.78,37.21 90 top
Y1  17.78,12.7 90 top

### Tracks (layer width: path | path; a pad name or v marks a point on that pad's centre or on a via)
3.3V  (16 unrouted)
!ENABLE!  (3 unrouted)
!INT!  (2 unrouted)
!RST!  (5 unrouted)
!SLEEP!  (2 unrouted)
A49885_!RESET!  (2 unrouted)
ADR  (1 unrouted)
AREF  (1 unrouted)
COILA+  (1 unrouted)
  pour Bottom (isolate 0.203, no thermals): 29.08,19.68 28.45,19.68 27.94,19.18 27.94,18.1 29.34,16.7 36.96,16.7 38.35,15.3 43.05,15.3 43.33,15.56 43.31,18.61 42.94,18.9 38.54,18.9 37.83,19.68 29.15,19.68 29.08,19.62
  pour Top (isolate 0.203, no thermals): 28.09,20.27 27.99,20.27 28.02,19.28 28.52,18.11 29.16,18.11 29.16,18.85
COILA-  (1 unrouted)
  pour Top (isolate 0.203, no thermals): 43.32,21.79 43.32,18.92 39.27,18.92 37.85,19.81 35.75,19.81 34.32,21.24 32.84,21.29 29.64,21.59 29.51,21.77 29.64,21.77 29.88,21.98 43.09,21.98
COILB+  (1 unrouted)
  pour Top (isolate 0.203, no thermals): 29.16,26.31 28.55,26.31 28,25.79 28,24.17 28.13,24.17 29.16,25.53
  pour Bottom (isolate 0.203, no thermals): 43.19,29.15 38.29,29.15 36.7,27.56 29.78,27.56 27.88,25.65 27.88,25.27 28.32,24.83 28.83,24.83 29.53,25.53 30.29,25.53 31.05,24.77 37.93,24.77 38.63,25.46 42.84,25.46 43.37,26 43.38,28.93
COILB-  (1 unrouted)
  pour Top (isolate 0.203, no thermals): 43.31,22.63 43.31,25.53 39.24,25.53 37.85,24.64 35.75,24.64 34.32,23.21 33.69,23.19 29.53,22.79 29.49,22.76 29.49,22.68 29.64,22.68 29.88,22.47 43.09,22.47
CUR_REF  (2 unrouted)
CUR_REF_PWM  (1 unrouted)
DIR  (1 unrouted)
DTR  (1 unrouted)
GND
  pour Top (isolate 0.203): 44.45,16.64 44.45,0 0,0 0,44.45 44.45,44.45 44.45,29.21 38.23,29.21 36.7,27.69 31.62,27.69 31.24,28.07 30.73,28.07 29.46,26.8 27.56,26.8 27.56,17.81 30.96,16.64
  pour Bottom (isolate 0.305, rank 3): 0,0 0,44.45 44.45,44.45 44.45,0
MISO  (1 unrouted)
MS1  (1 unrouted)
MS2  (1 unrouted)
MS3  (1 unrouted)
N$1  (1 unrouted)
N$4  (1 unrouted)
N$5  (1 unrouted)
N$7  (2 unrouted)
N$8  (1 unrouted)
N$9  (1 unrouted)
N$10  (1 unrouted)
N$11  (1 unrouted)
N$12  (1 unrouted)
N$13  (1 unrouted)
N$14  (1 unrouted)
N$19  (1 unrouted)
N$20  (1 unrouted)
N$21  (1 unrouted)
N$26  (1 unrouted)
N$27  (1 unrouted)
N$31  (1 unrouted)
  pour Top (isolate 0.203, no thermals): 31.62,25.15 29.64,23.25 29.48,23.25 29.5,23.19 31.62,23.62
N$32  (1 unrouted)
  pour Top (isolate 0.203, no thermals): 29.51,21.26 29.51,21.18 29.67,21.18 31.62,19.3 31.62,20.83
RXI  (1 unrouted)
SCK  (2 unrouted)
SCL  (3 unrouted)
SDA  (3 unrouted)
STEP  (2 unrouted)
TXO  (1 unrouted)
VIN  (6 unrouted)
  pour Top (isolate 0.203, no thermals): 29.62,26.37 30.3,26.37 30.48,25.27 30.48,24.77 29.38,23.67 28.49,23.67 28.49,23.84 29.62,25.37
  pour Top (isolate 0.203, no thermals): 29.46,20.7 30.48,19.68 30.48,18.92 30.35,18.14 29.59,18.14 29.62,18.95 28.47,20.62 28.47,20.75

### Text on the board
tPlace: Serial
tValues: Brian Schmalz: http://schmalzhaus.com/BigEasyDriver/index.html
tDocu: THIS IS A 4-LAYER BOARD.